# Altium schematic sheet 03-POWER.SchDoc: 手持设备通讯板
size A4; Address1: 张三; Address2: 441521200506202339; Address3: 15812345678; SheetNumber: 5; SheetTotal: 5
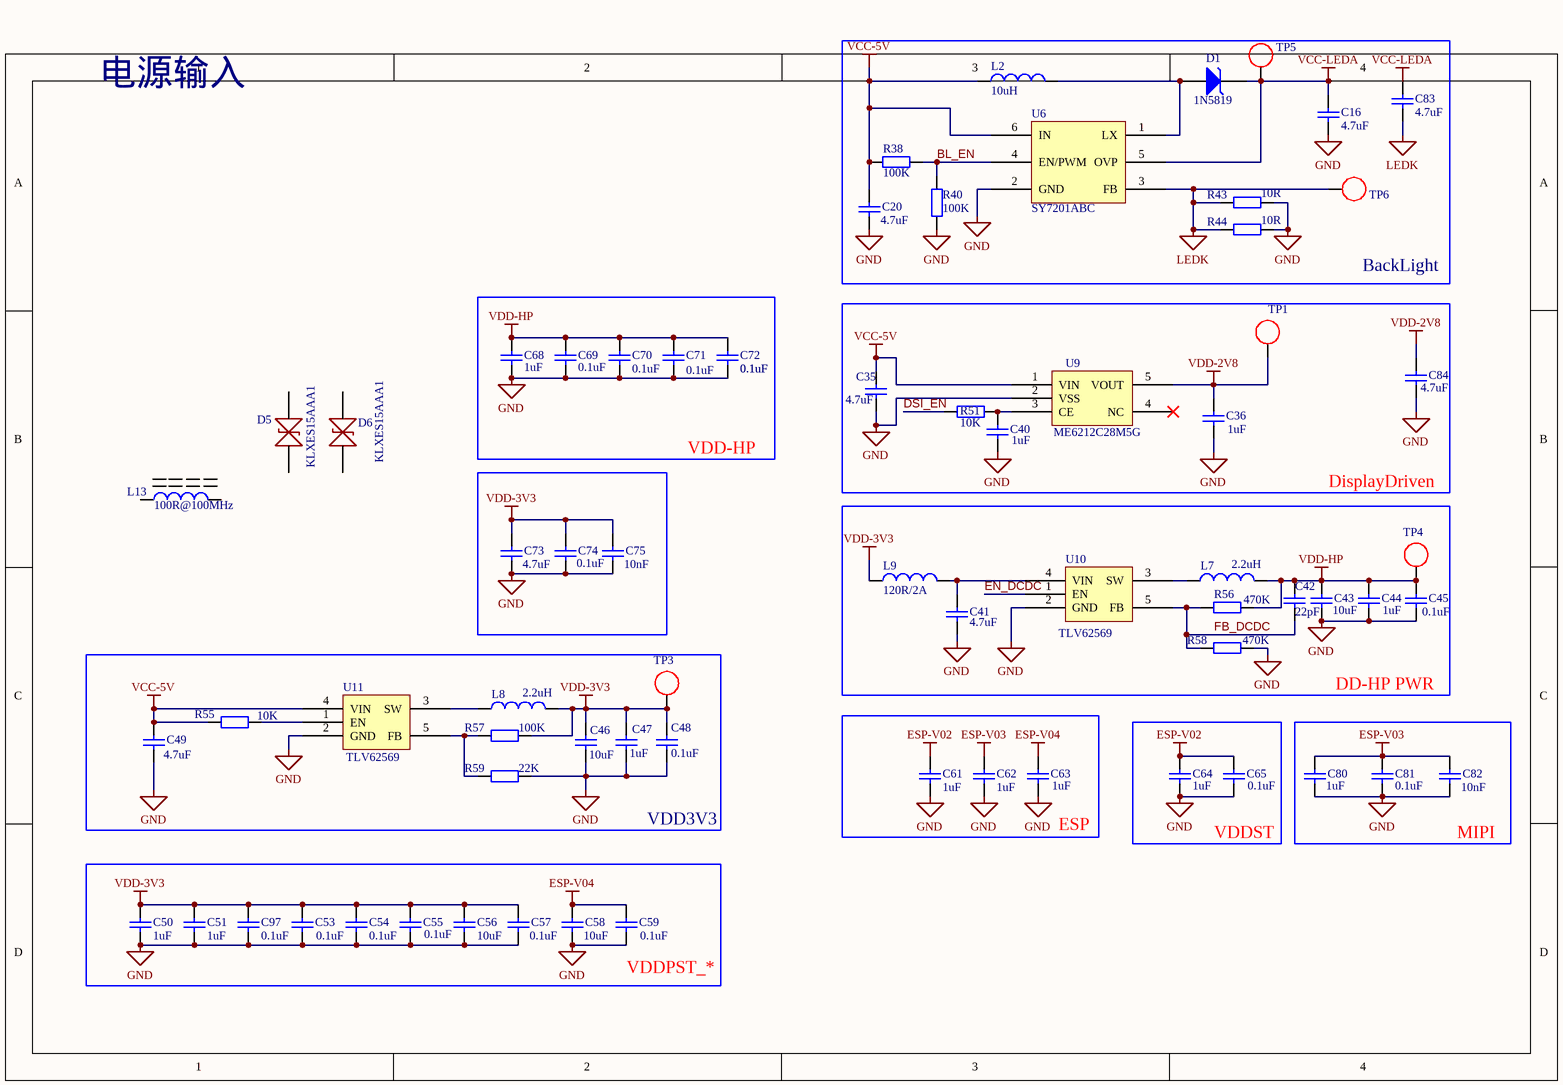
[diagram p0: 03-POWER.SchDoc]

## Parts
C16  4.7uF  [C0603]
C20  4.7uF  [C0603]
C35  4.7uF  [C0603]
C36  1uF  [C0402]
C40  1uF  [C0402]
C41  4.7uF  [C0603]
C42  22pF  [C0402]
C43  10uF  [C0805]
C44  1uF  [C0402]
C45  0.1uF  [C0402]
C46  10uF  [C0805]
C47  1uF  [C0402]
C48  0.1uF  [C0402]
C49  4.7uF  [C0603]
C50  1uF  [C0402]
C51  1uF  [C0402]
C53  0.1uF  [C0402]
C54  0.1uF  [C0402]
C55  0.1uF  [C0402]
C56  10uF  [C0805]
C57  0.1uF  [C0402]
C58  10uF  [C0805]
C59  0.1uF  [C0402]
C61  1uF  [C0402]
C62  1uF  [C0402]
C63  1uF  [C0402]
C64  1uF  [C0402]
C65  0.1uF  [C0402]
C68  1uF  [C0402]
C69  0.1uF  [C0402]
C70  0.1uF  [C0402]
C71  0.1uF  [C0402]
C72  0.1uF  [C0402]
C73  4.7uF  [C0603]
C74  0.1uF  [C0402]
C75  10nF  [C0402]
C80  1uF  [C0402]
C81  0.1uF  [C0402]
C82  10nF  [C0402]
C83  4.7uF  [C0603]
C84  4.7uF  [C0603]
C97  0.1uF  [C0402]
D1  1N5819  [SOD-323_L1.8-W1.3-LS2.5-RD]
D5  KLXES15AAA1  [D0402-BI]
D6  KLXES15AAA1  [D0402-BI]
L2  10uH  [L0603]
L7  2.2uH  [IND-SMD_L2.5-W2.0_MHCHL2520]
L8  2.2uH  [IND-SMD_L2.5-W2.0_MHCHL2520]
L9  120R/2A  [L0603]
L13  100R@100MHz  [LED0402-RD]
R38  100K  [R0402]
R40  100K  [R0402]
R43  10R  [R0805]
R44  10R  [R0805]
R51  10K  [R0402]
R55  10K  [R0402]
R56  470K  [R0402]
R57  100K  [R0402]
R58  470K  [R0402]
R59  22K  [R0402]
TP1  TP13  [Test-Point-1*1mm]  (value not drawn)
TP3  TP13  [Test-Point-1*1mm]  (value not drawn)
TP4  TP13  [Test-Point-1*1mm]  (value not drawn)
TP5  TP13  [Test-Point-1*1mm]  (value not drawn)
TP6  TP13  [Test-Point-1*1mm]  (value not drawn)
U6  SY7201ABC  [SOT-23-6_L2.9-W1.6-P0.95-LS2.8-BL]
U9  ME6212C28M5G  [SOT-23-5_L3.0-W1.7-P0.95-LS2.8-BR]
U10  TLV62569  [SOT-23-5_L3.0-W1.7-P0.95-LS2.8-BR]
U11  TLV62569  [SOT-23-5_L3.0-W1.7-P0.95-LS2.8-BR]

## Blocks framed on the sheet
BackLight: C16 C20 C83 D1 L2 R38 R40 R43 R44 TP5 TP6 U6
VDD-HP: C68-C72
DisplayDriven: C35 C36 C40 C84 R51 TP1 U9
DD-HP PWR: C41-C45 L7 L9 R56 R58 TP4 U10
VDD3V3: C46-C49 L8 R55 R57 R59 TP3 U11
ESP: C61-C63
VDDST: C64 C65
MIPI: C80-C82
VDDPST_*: C50 C51 C53-C59 C97

## Nets
ESP-V02: C61.2 C64.2 C65.2
ESP-V03: C62.2 C80.2 C81.2 C82.2
ESP-V04: C58.2 C59.2 C63.2
GND: C16.1 C20.1 C35.2 C36.2 C40.2 C41.2 C43.2 C44.2 C45.2 C46.2 C47.2 C48.2 C49.2 C50.1 C51.1 C53.1 C54.1 C55.1 C56.1 C57.1 C58.1 C59.1 C61.1 C62.1 C63.1 C64.1 C65.1 C68.1 C69.1 C70.1 C71.1 C72.1 C73.1 C74.1 C75.1 C80.1 C81.1 C82.1 C84.2 C97.1 R40.1 R43.1 R44.1 R58.2 R59.2 U6.2(GND) U9.2(VSS) U10.2(GND) U11.2(GND)
LEDK: C83.1 R43.2 R44.2 TP6.1 U6.3(FB)
VCC-5V: C20.2 C35.1 C49.1 L2.1 R38.1 R55.1 U6.6(IN) U9.1(VIN) U11.4(VIN)
VCC-LEDA: C16.2 C83.2 D1.1(K) TP5.1 U6.5(OVP)
VDD-2V8: C36.1 C84.1 TP1.1 U9.5(VOUT)
VDD-3V3: C46.1 C47.1 C48.1 C50.2 C51.2 C53.2 C54.2 C55.2 C56.2 C57.2 C73.2 C74.2 C75.2 C97.2 L8.2 L9.1 R57.2 TP3.1
VDD-HP: C42.1 C43.1 C44.1 C45.1 C68.2 C69.2 C70.2 C71.2 C72.2 L7.2 R56.2 TP4.1
BL_EN: R38.2 R40.2 U6.4(EN/PWM)
DSI_EN: R51.2
EN_DCDC: U10.1(EN)
FB_DCDC: C42.2 R56.1 R58.1 U10.5(FB)
NetC40_1: C40.1 R51.1 U9.3(CE)
NetC41_1: C41.1 L9.2 U10.4(VIN)
NetD1_2: D1.2(A) L2.2 U6.1(LX)
NetL7_1: L7.1 U10.3(SW)
NetL8_1: L8.1 U11.3(SW)
NetR55_2: R55.2 U11.1(EN)
NetR57_1: R57.1 R59.1 U11.5(FB)

Not connected (* = marked no-connect by the designer): D5 1 2; D6 1 2; L13 1 2; U9 4(NC)*

## Notes on the sheet
- 电源输入
- 选手信息
- 图页名称
- 当前日期
- 当前时间
- 项目名称
- 第          幅
- 共          幅

## Library data of the parts
C16 C20 C35 C36 C40-C51 C53-C59 C61-C65 C68-C75 C80-C84 C97 = Capacitor: SimulationGenericComponent: True
  C16 C20 C35 C41 C49 C73 C83 C84: Value: 4.7uF
  C36 C40 C44 C47 C50 C51 C61-C64 C68 C80: Value: 1uF
  C42: Value: 22pF
  C43 C46 C56 C58: Value: 10uF
  C45 C48 C53-C55 C57 C59 C65 C69-C72 C74 C81 C97: Value: 0.1uF
  C75 C82: Value: 10nF
D1 = Suppressor Single: AF: 1; BV: 0; BV_MAX: 1e99; EG: 1.11; FC: 0.5; IBV: 0.001; IS: 1e-14; MJSW: 0.33; NTUN: 30; TNOM: 27; XTI: 3; SimulationGenericComponent: True; CJO: 0; CJP: 0; CTA: 0; CTP: 0; FCS: 0.5; FV_MAX: 1e99; IKF: 0; IKR: 0; ISR: 1e-14; JSW: 0; JTUN: 0; JTUNSW: 0; KEG: 1; KF: 0; LEVEL: 1; N: 1; NBV: 1; NR: 1; NS: 1; PHP: 1; RS: 0; TCV: 0; TLEV: 0; TLEVC: 0; TM1: 0; TM2: 0; TPB: 0; TPHP: 0; TRS: 0; TRS2: 0; TT: 0; TTT1: 0; TTT2: 0; VJ: 1; XTITUN: 3
L2 L7-L9 = Inductor: SimulationGenericComponent: True
  L2: Value: 10uH
  L7 L8: Value: 2.2uH
  L9: Value: 120R/2A
L13 = Inductor: SimulationGenericComponent: True; Value: 100R
R38 R40 = Res2: Resistor; Value: NC; Published: 8-Jun-2000; LatestRevisionDate: 17-Jul-2002; LatestRevisionNote: Re-released for DXP Platform.; PackageReference: AXIAL-0.4; Publisher: Altium Limited; PackageDescription: Axial Device, Thru-Hole; 2 Leads; 0.4 in Pin Spacing
R43 R44 R51 R55-R59 = Res2: Resistor; Published: 8-Jun-2000; LatestRevisionDate: 17-Jul-2002; LatestRevisionNote: Re-released for DXP Platform.; PackageReference: AXIAL-0.4; Publisher: Altium Limited; PackageDescription: Axial Device, Thru-Hole; 2 Leads; 0.4 in Pin Spacing
  R43 R44: Value: 10R
  R51 R55: Value: 10K
  R56 R58: Value: 470K
  R57: Value: 100K
  R59: Value: 22K
TP1 TP3-TP6 = TP?